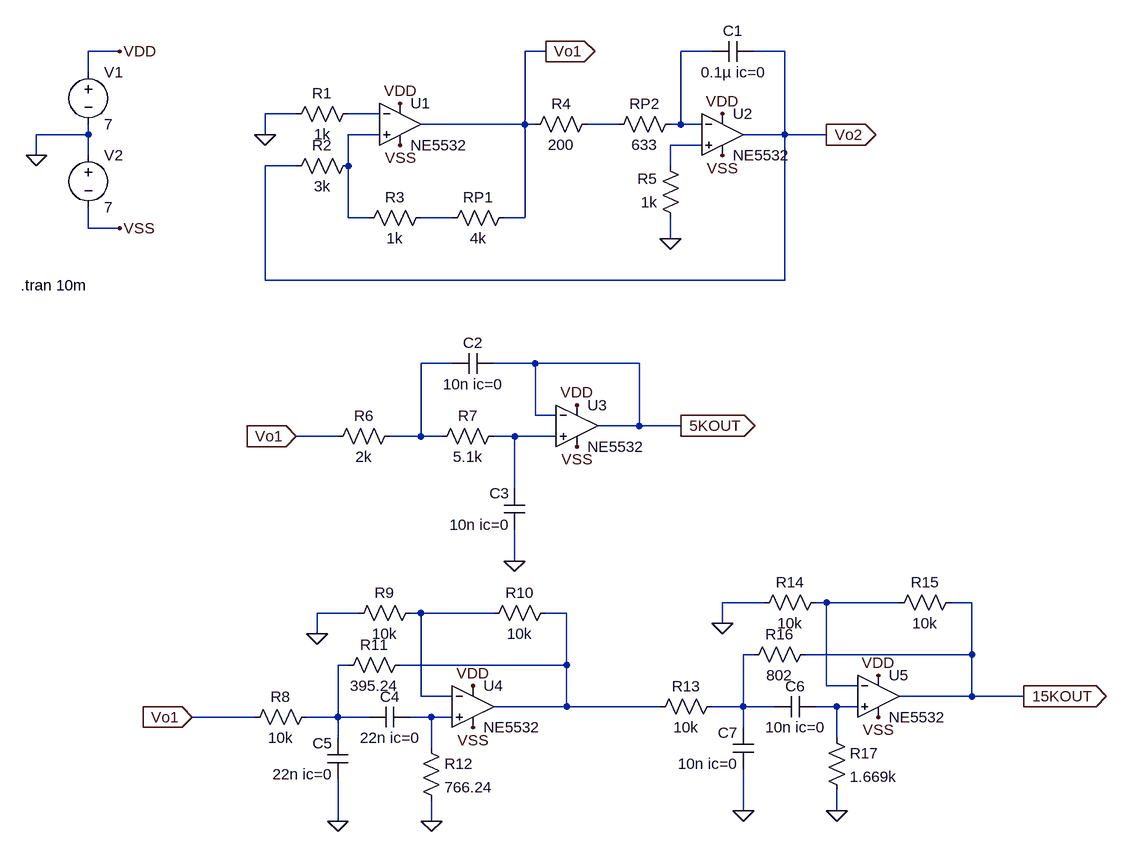
[diagram p0: schematic class4-wave.asc]
class4-wave.asc, the LTspice schematic file:
Version 4
SHEET 1 1336 1220
WIRE -352 16 -400 16
WIRE 304 16 272 16
WIRE 560 16 512 16
WIRE 672 16 624 16
WIRE -400 48 -400 16
WIRE -80 112 -128 112
WIRE 48 112 0 112
WIRE 272 128 272 16
WIRE 272 128 112 128
WIRE 288 128 272 128
WIRE 416 128 368 128
WIRE 512 128 512 16
WIRE 512 128 496 128
WIRE 544 128 512 128
WIRE -400 144 -400 128
WIRE -400 144 -480 144
WIRE -128 144 -128 112
WIRE 48 144 0 144
WIRE 672 144 672 16
WIRE 672 144 608 144
WIRE 736 144 672 144
WIRE 544 160 496 160
WIRE -480 176 -480 144
WIRE -400 176 -400 144
WIRE -80 192 -128 192
WIRE 0 192 0 144
WIRE 496 192 496 160
WIRE 0 272 0 192
WIRE 32 272 0 272
WIRE 160 272 112 272
WIRE 272 272 272 128
WIRE 272 272 240 272
WIRE -400 288 -400 256
WIRE -352 288 -400 288
WIRE 496 304 496 272
WIRE -128 368 -128 192
WIRE 672 368 672 144
WIRE 672 368 -128 368
WIRE 160 496 112 496
WIRE 288 496 224 496
WIRE 448 496 288 496
WIRE 288 576 288 496
WIRE 320 576 288 576
WIRE 448 592 448 496
WIRE 448 592 384 592
WIRE 512 592 448 592
WIRE -16 608 -80 608
WIRE 112 608 112 496
WIRE 112 608 64 608
WIRE 144 608 112 608
WIRE 256 608 224 608
WIRE 320 608 256 608
WIRE 256 688 256 608
WIRE 256 800 256 752
WIRE 640 864 576 864
WIRE 736 864 720 864
WIRE 848 864 736 864
WIRE 960 864 928 864
WIRE 16 880 -48 880
WIRE 112 880 96 880
WIRE 224 880 112 880
WIRE 336 880 304 880
WIRE 576 896 576 864
WIRE -48 912 -48 880
WIRE 624 944 608 944
WIRE 960 944 960 864
WIRE 960 944 704 944
WIRE 0 960 -16 960
WIRE 336 960 336 880
WIRE 336 960 80 960
WIRE 736 992 736 864
WIRE 784 992 736 992
WIRE 112 1008 112 880
WIRE 160 1008 112 1008
WIRE 960 1008 960 944
WIRE 960 1008 848 1008
WIRE 1040 1008 960 1008
WIRE 336 1024 336 960
WIRE 336 1024 224 1024
WIRE 480 1024 336 1024
WIRE 608 1024 608 944
WIRE 608 1024 560 1024
WIRE 656 1024 608 1024
WIRE 752 1024 720 1024
WIRE 784 1024 752 1024
WIRE -144 1040 -240 1040
WIRE -16 1040 -16 960
WIRE -16 1040 -64 1040
WIRE 32 1040 -16 1040
WIRE 128 1040 96 1040
WIRE 160 1040 128 1040
WIRE 608 1056 608 1024
WIRE -16 1072 -16 1040
WIRE 752 1072 752 1024
WIRE 128 1088 128 1040
WIRE 608 1184 608 1120
WIRE 752 1184 752 1152
WIRE -16 1200 -16 1136
WIRE 128 1200 128 1168
FLAG -480 176 0
FLAG -352 16 VDD
FLAG -352 288 VSS
FLAG 80 96 VDD
FLAG 80 160 VSS
FLAG -128 144 0
FLAG 576 112 VDD
FLAG 576 176 VSS
FLAG 496 304 0
FLAG 304 16 Vo1
IOPIN 304 16 Out
FLAG 736 144 Vo2
IOPIN 736 144 Out
FLAG 352 560 VDD
FLAG 352 624 VSS
FLAG -80 608 Vo1
IOPIN -80 608 In
FLAG 512 592 5KOUT
IOPIN 512 592 Out
FLAG 256 800 0
FLAG 192 992 VDD
FLAG 192 1056 VSS
FLAG -48 912 0
FLAG -240 1040 Vo1
IOPIN -240 1040 In
FLAG 128 1200 0
FLAG -16 1200 0
FLAG 816 976 VDD
FLAG 816 1040 VSS
FLAG 576 896 0
FLAG 752 1184 0
FLAG 608 1184 0
FLAG 1040 1008 15KOUT
IOPIN 1040 1008 Out
SYMBOL EXTRA\\AudioOpamp\\TI\\NE5532 80 128 R0
SYMATTR InstName U1
SYMBOL voltage -400 32 R0
WINDOW 123 0 0 Left 0
WINDOW 39 0 0 Left 0
SYMATTR InstName V1
SYMATTR Value 7
SYMBOL voltage -400 160 R0
WINDOW 123 0 0 Left 0
WINDOW 39 0 0 Left 0
SYMATTR InstName V2
SYMATTR Value 7
SYMBOL res 16 96 R90
WINDOW 0 0 56 VBottom 2
WINDOW 3 32 56 VTop 2
SYMATTR InstName R1
SYMATTR Value 1k
SYMBOL res 16 176 R90
WINDOW 0 0 56 VBottom 2
WINDOW 3 32 56 VTop 2
SYMATTR InstName R2
SYMATTR Value 3k
SYMBOL res 128 256 R90
WINDOW 0 0 56 VBottom 2
WINDOW 3 32 56 VTop 2
SYMATTR InstName R3
SYMATTR Value 1k
SYMBOL res 384 112 R90
WINDOW 0 0 56 VBottom 2
WINDOW 3 32 56 VTop 2
SYMATTR InstName R4
SYMATTR Value 200
SYMBOL res 512 288 R180
WINDOW 0 36 76 Left 2
WINDOW 3 36 40 Left 2
SYMATTR InstName R5
SYMATTR Value 1k
SYMBOL res 144 288 R270
WINDOW 0 32 56 VTop 2
WINDOW 3 0 56 VBottom 2
SYMATTR InstName RP1
SYMATTR Value 4k
SYMBOL res 400 144 R270
WINDOW 0 32 56 VTop 2
WINDOW 3 0 56 VBottom 2
SYMATTR InstName RP2
SYMATTR Value 633
SYMBOL EXTRA\\AudioOpamp\\TI\\NE5532 576 144 R0
SYMATTR InstName U2
SYMBOL cap 624 0 R90
WINDOW 0 0 32 VBottom 2
WINDOW 3 32 32 VTop 2
SYMATTR InstName C1
SYMATTR Value 0.1µ ic=0
SYMBOL res 80 592 R90
WINDOW 0 0 56 VBottom 2
WINDOW 3 32 56 VTop 2
SYMATTR InstName R6
SYMATTR Value 2k
SYMBOL res 240 592 R90
WINDOW 0 0 56 VBottom 2
WINDOW 3 32 56 VTop 2
SYMATTR InstName R7
SYMATTR Value 5.1k
SYMBOL cap 224 480 R90
WINDOW 0 0 32 VBottom 2
WINDOW 3 32 32 VTop 2
SYMATTR InstName C2
SYMATTR Value 10n ic=0
SYMBOL cap 272 752 R180
WINDOW 0 24 56 Left 2
WINDOW 3 24 8 Left 2
SYMATTR InstName C3
SYMATTR Value 10n ic=0
SYMBOL EXTRA\\AudioOpamp\\TI\\NE5532 352 592 R0
SYMATTR InstName U3
SYMBOL EXTRA\\AudioOpamp\\TI\\NE5532 192 1024 R0
SYMATTR InstName U4
SYMBOL cap 96 1024 R90
WINDOW 0 0 32 VBottom 2
WINDOW 3 32 32 VTop 2
SYMATTR InstName C4
SYMATTR Value 22n ic=0
SYMBOL cap 0 1136 R180
WINDOW 0 24 56 Left 2
WINDOW 3 24 8 Left 2
SYMATTR InstName C5
SYMATTR Value 22n ic=0
SYMBOL res -48 1024 R90
WINDOW 0 0 56 VBottom 2
WINDOW 3 32 56 VTop 2
SYMATTR InstName R8
SYMATTR Value 10k
SYMBOL res 112 864 R90
WINDOW 0 0 56 VBottom 2
WINDOW 3 32 56 VTop 2
SYMATTR InstName R9
SYMATTR Value 10k
SYMBOL res 320 864 R90
WINDOW 0 0 56 VBottom 2
WINDOW 3 32 56 VTop 2
SYMATTR InstName R10
SYMATTR Value 10k
SYMBOL res 96 944 R90
WINDOW 0 0 56 VBottom 2
WINDOW 3 32 56 VTop 2
SYMATTR InstName R11
SYMATTR Value 395.24
SYMBOL res 112 1072 R0
SYMATTR InstName R12
SYMATTR Value 766.24
SYMBOL EXTRA\\AudioOpamp\\TI\\NE5532 816 1008 R0
SYMATTR InstName U5
SYMBOL cap 720 1008 R90
WINDOW 0 0 32 VBottom 2
WINDOW 3 32 32 VTop 2
SYMATTR InstName C6
SYMATTR Value 10n ic=0
SYMBOL cap 624 1120 R180
WINDOW 0 24 56 Left 2
WINDOW 3 24 8 Left 2
SYMATTR InstName C7
SYMATTR Value 10n ic=0
SYMBOL res 576 1008 R90
WINDOW 0 0 56 VBottom 2
WINDOW 3 32 56 VTop 2
SYMATTR InstName R13
SYMATTR Value 10k
SYMBOL res 736 848 R90
WINDOW 0 0 56 VBottom 2
WINDOW 3 32 56 VTop 2
SYMATTR InstName R14
SYMATTR Value 10k
SYMBOL res 944 848 R90
WINDOW 0 0 56 VBottom 2
WINDOW 3 32 56 VTop 2
SYMATTR InstName R15
SYMATTR Value 10k
SYMBOL res 720 928 R90
WINDOW 0 0 56 VBottom 2
WINDOW 3 32 56 VTop 2
SYMATTR InstName R16
SYMATTR Value 802
SYMBOL res 736 1056 R0
SYMATTR InstName R17
SYMATTR Value 1.669k
TEXT -504 376 Left 2 !.tran 10m

The netlist it stands for:
* class4-wave.asc
XU1 N004 N002 VDD VSS Vo1 NE5532  ; pins In+ In- V+ V- OUT
V1 VDD 0 7
V2 0 VSS 7
R1 N002 0 1k
R2 N004 Vo2 3k
R3 N006 N004 1k
R4 N003 Vo1 200
R5 0 N005 1k
RP1 N006 Vo1 4k
RP2 N003 N001 633
XU2 N005 N001 VDD VSS Vo2 NE5532  ; pins In+ In- V+ V- OUT
C1 Vo2 N001 0.1µ ic=0
R6 N007 Vo1 2k
R7 N008 N007 5.1k
C2 5KOUT N007 10n ic=0
C3 0 N008 10n ic=0
XU3 N008 5KOUT VDD VSS 5KOUT NE5532  ; pins In+ In- V+ V- OUT
XU4 N015 N010 VDD VSS N011 NE5532  ; pins In+ In- V+ V- OUT
C4 N015 N013 22n ic=0
C5 0 N013 22n ic=0
R8 N013 Vo1 10k
R9 N010 0 10k
R10 N011 N010 10k
R11 N011 N013 395.24
R12 N015 0 766.24
XU5 N014 N009 VDD VSS 15KOUT NE5532  ; pins In+ In- V+ V- OUT
C6 N014 N012 10n ic=0
C7 0 N012 10n ic=0
R13 N012 N011 10k
R14 N009 0 10k
R15 15KOUT N009 10k
R16 15KOUT N012 802
R17 N014 0 1.669k
.tran 10m
.backanno
.end